# Altium schematic sheet schematic.SchDoc
size A4; SheetNumber: 6; SheetTotal: 29
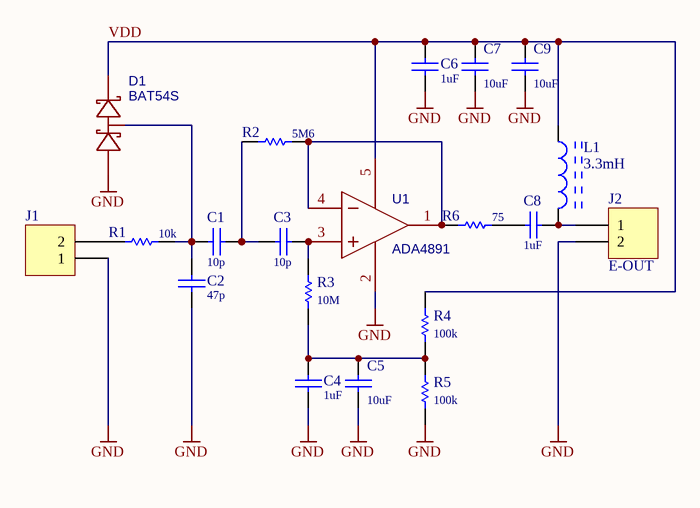
[diagram p0: schematic.SchDoc]

## Parts
C1  10p  [C0603]
C2  47p  [C0603]
C3  10p  [C0603]
C4  1uF  [C0603]
C5  10uF  [C1206]
C6  1uF  [C0603]
C7  10uF  [C1206]
C8  1uF  [C0603]
C9  10uF  [C1206]
D1  BAT54S  [SOT-23]
J1  CONN_DG308-2.54-2P  [CONN_DG308-2.54-2P]  (value not drawn)
J2  E-OUT  [CONN_F_TYPE]
L1  3.3mH  [IND-TH_BD5.0-L10.5-P14.50-D0.6]
R1  10k  [R0603]
R2  5M6  [R0603]
R3  10M  [R0603]
R4  100k  [R0603]
R5  100k  [R0603]
R6  75  [R0603]
U1  ADA4891  [SOT-23-5]

## Nets
GND: C2.2 C4.1 C5.1 C6.1 C7.1 C9.1 D1.1(A) J1.1 J2.2 R5.1 U1.2(-VS)
VDD: C6.2 C7.2 C9.2 D1.2(K) L1.1 R4.2 U1.5(+VS)
NetC1_1: C1.1 C3.2 R2.1
NetC1_2: C1.2 C2.1 D1.3 R1.2
NetC3_1: C3.1 R3.2 U1.3(+IN)
NetC4_2: C4.2 C5.2 R3.1 R4.1 R5.2
NetC8_1: C8.1 J2.1 L1.2
NetC8_2: C8.2 R6.2
NetJ1_2: J1.2 R1.1
NetR2_2: R2.2 R6.1 U1.1(OUT) U1.4(-IN)

## Library data of the parts
C1 C3 = CAP: 10pF 0603
C2 = CAP: 47pF 0603
C4 C6 C8 = CAP: 1uF 0603
C5 C7 C9 = CAP: 10uf 50V 1206
D1 = BAT54S_C916425
J1 J2 = CONN MOLEX HDR-M 1x4
L1 = SRN3015-4R7M: CKL0510*3.3mH/K-A T
R1 = R0201: 10k 0603
R2 = R0201: 5M6 0603
R3 = R0201: 10M 0603
R4 R5 = R0201: 100k 0603
R6 = R0201: 75R 0603
U1 = ADA4891-1ARJZ-R7